# EAGLE design COTS (EAGLE 9.6.2)
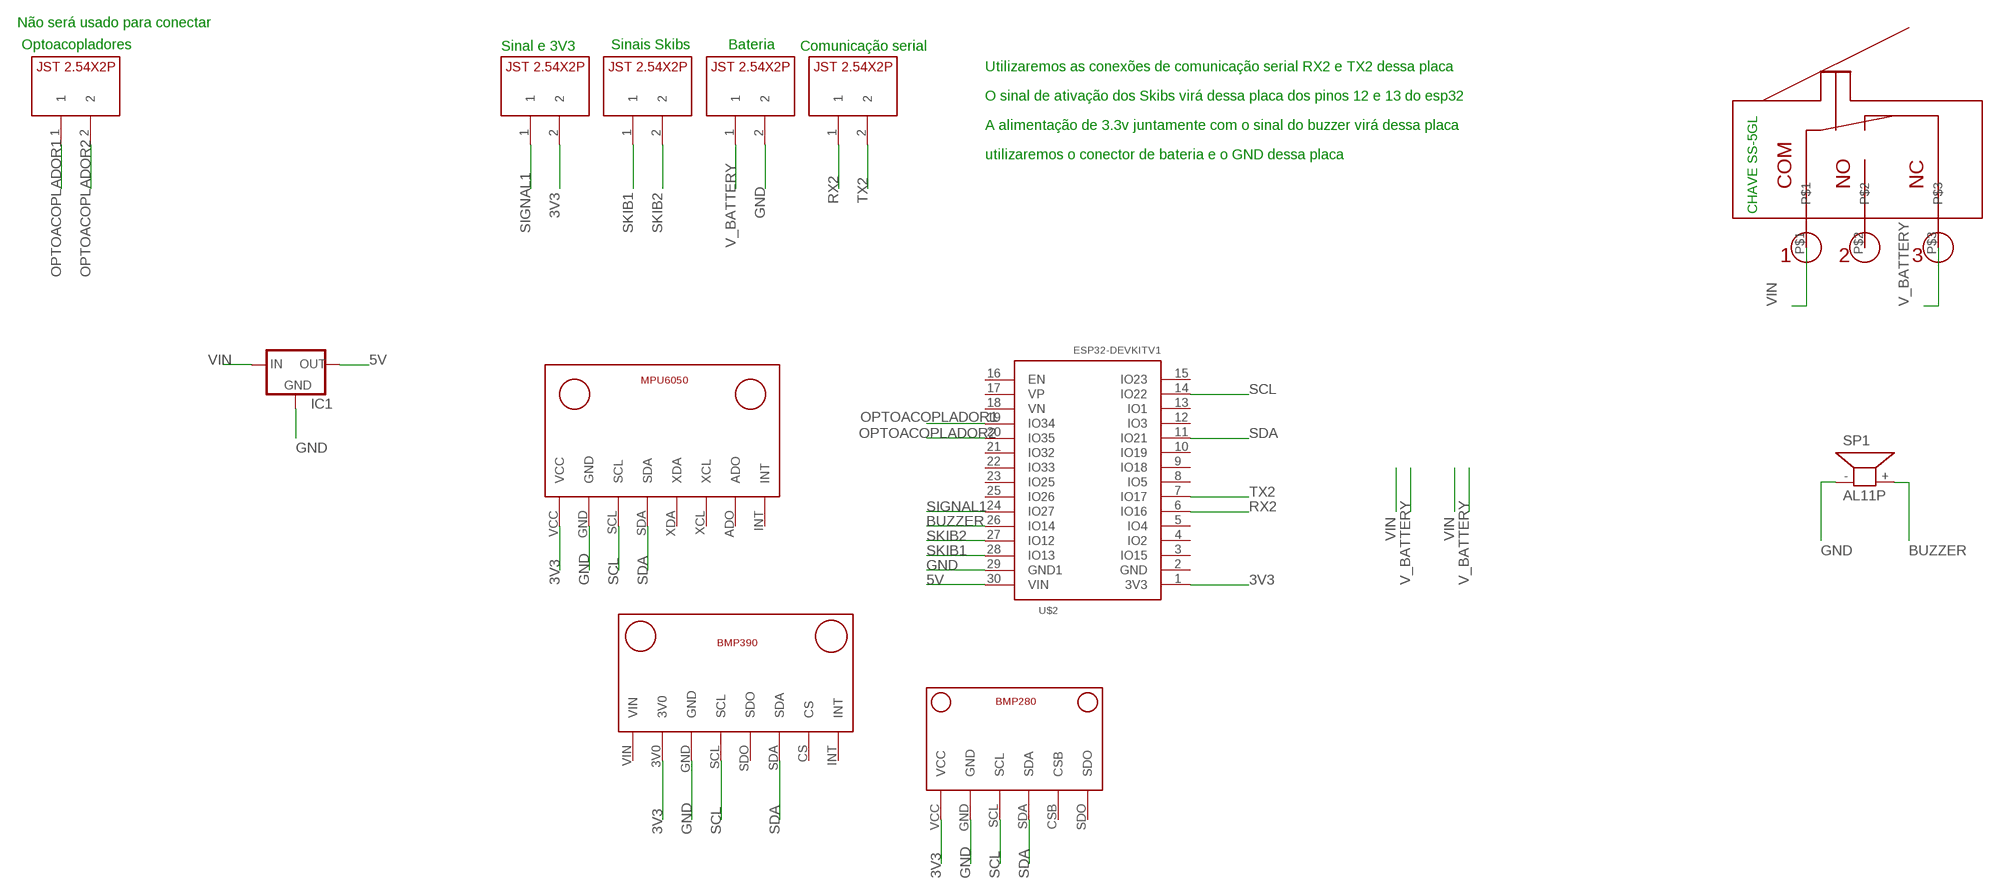
[diagram p0: schematic, sheet 1]

## Parts
IC1  78XXL  [78XXL]
SP1  AL11P  [AL11P]
U$1  MPU6050V1  [MPU6050_FOOTPRINT]
U$2  ESP32DEVKITV1  [ESP32-DEVKITV1]
U$3  BMP390V1  [BMP390_FOOTPRINT]
U$4  JST2.54X2P  [JST2.54X2P_FOOTPRINT]
U$5  JST2.54X2P  [JST2.54X2P_FOOTPRINT]
U$6  JST2.54X2P  [JST2.54X2P_FOOTPRINT]
U$7  JST2.54X2P  [JST2.54X2P_FOOTPRINT]
U$8  CHAVE_SS-5GL  [CHAVESS-5GL]
U$9  JST2.54X2P  [JST2.54X2P_FOOTPRINT]
U$10  BMP280V1  [BMP280_FOOTPRINT]

## Nets
3V3: U$1.VCC U$2.1(3V3) U$3.3V0 U$5.2 U$10.VCC
5V: IC1.OUT U$2.30(VIN)
BUZZER: SP1.+ U$2.26(IO14)
GND: IC1.GND SP1.- U$1.GND U$2.29(GND1) U$3.GND U$6.2 U$10.GND
OPTOACOPLADOR1: U$2.19(IO34) U$9.1
OPTOACOPLADOR2: U$2.20(IO35) U$9.2
RX2: U$2.6(IO16) U$7.1
SCL: U$1.SCL U$2.14(IO22) U$3.SCL U$10.SCL
SDA: U$1.SDA U$2.11(IO21) U$3.SDA U$10.SDA
SIGNAL1: U$2.24(IO27) U$5.1
SKIB1: U$2.28(IO13) U$4.1
SKIB2: U$2.27(IO12) U$4.2
TX2: U$2.7(IO17) U$7.2
V_BATTERY: U$6.1 U$8.P$3
VIN: IC1.IN U$8.P$1
Unconnected: U$1.ADO U$1.INT U$1.XCL U$1.XDA U$2.2(GND) U$2.3(IO15) U$2.4(IO2) U$2.5(IO4) U$2.8(IO5) U$2.9(IO18) U$2.10(IO19) U$2.12(IO3) U$2.13(IO1) U$2.15(IO23) U$2.16(EN) U$2.17(VP) U$2.18(VN) U$2.21(IO32) U$2.22(IO33) U$2.23(IO25) U$2.25(IO26) U$3.CS U$3.INT U$3.SDO U$3.VIN U$8.P$2 U$10.CSB U$10.SDO

## Notes on the sheet
- Não será usado para conectar
- Optoacopladores | Sinal e 3V3 | Sinais Skibs | Bateria | Comunicação serial
- Utilizaremos as conexões de comunicação serial RX2 e TX2 dessa placa
- O sinal de ativação dos Skibs virá dessa placa dos pinos 12 e 13 do esp32
- A alimentação de 3.3v juntamente com o sinal do buzzer virá dessa placa
- utilizaremos o conector de bateria e o GND dessa placa

## Library data of the parts
IC1 = v-reg:78XXL: VOLTAGE REGULATOR
SP1 = buzzer:AL11P: SPEAKER Source: Buerklin; OC_FARNELL: unknown; OC_NEWARK: unknown
U$1 = CRD:MPU6050: Acelerômetro e Giroscópio
U$2 = ESP32-DEVKITV1:ESP32DEVKITV1
U$3 = CRD:BMP390: Sensor barométrico
U$4-U$7 U$9 = CRD:JST2.54X2P: Conector JST 2 pinos (2.54mm de distância entre pinos)
U$8 = CRD:CHAVE_SS-5GL
U$10 = CRD:BMP280: Sensor barométrico

## Board
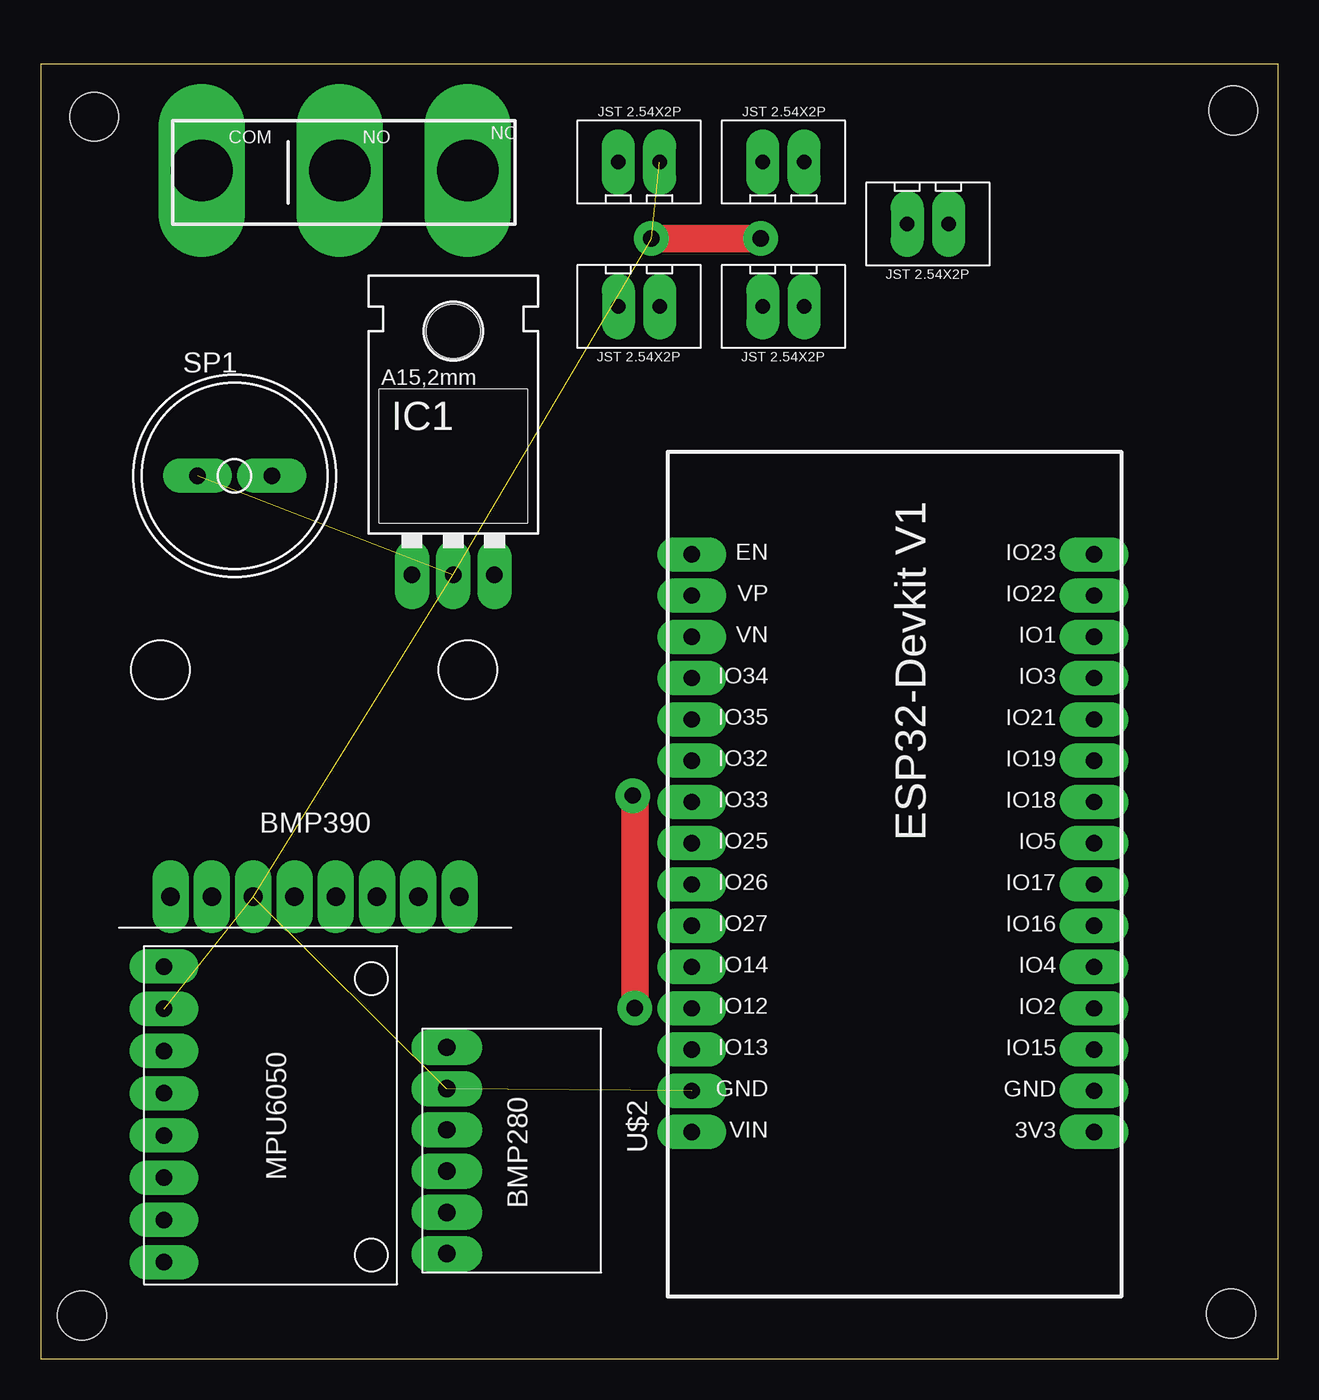
[diagram p1: board, top side]
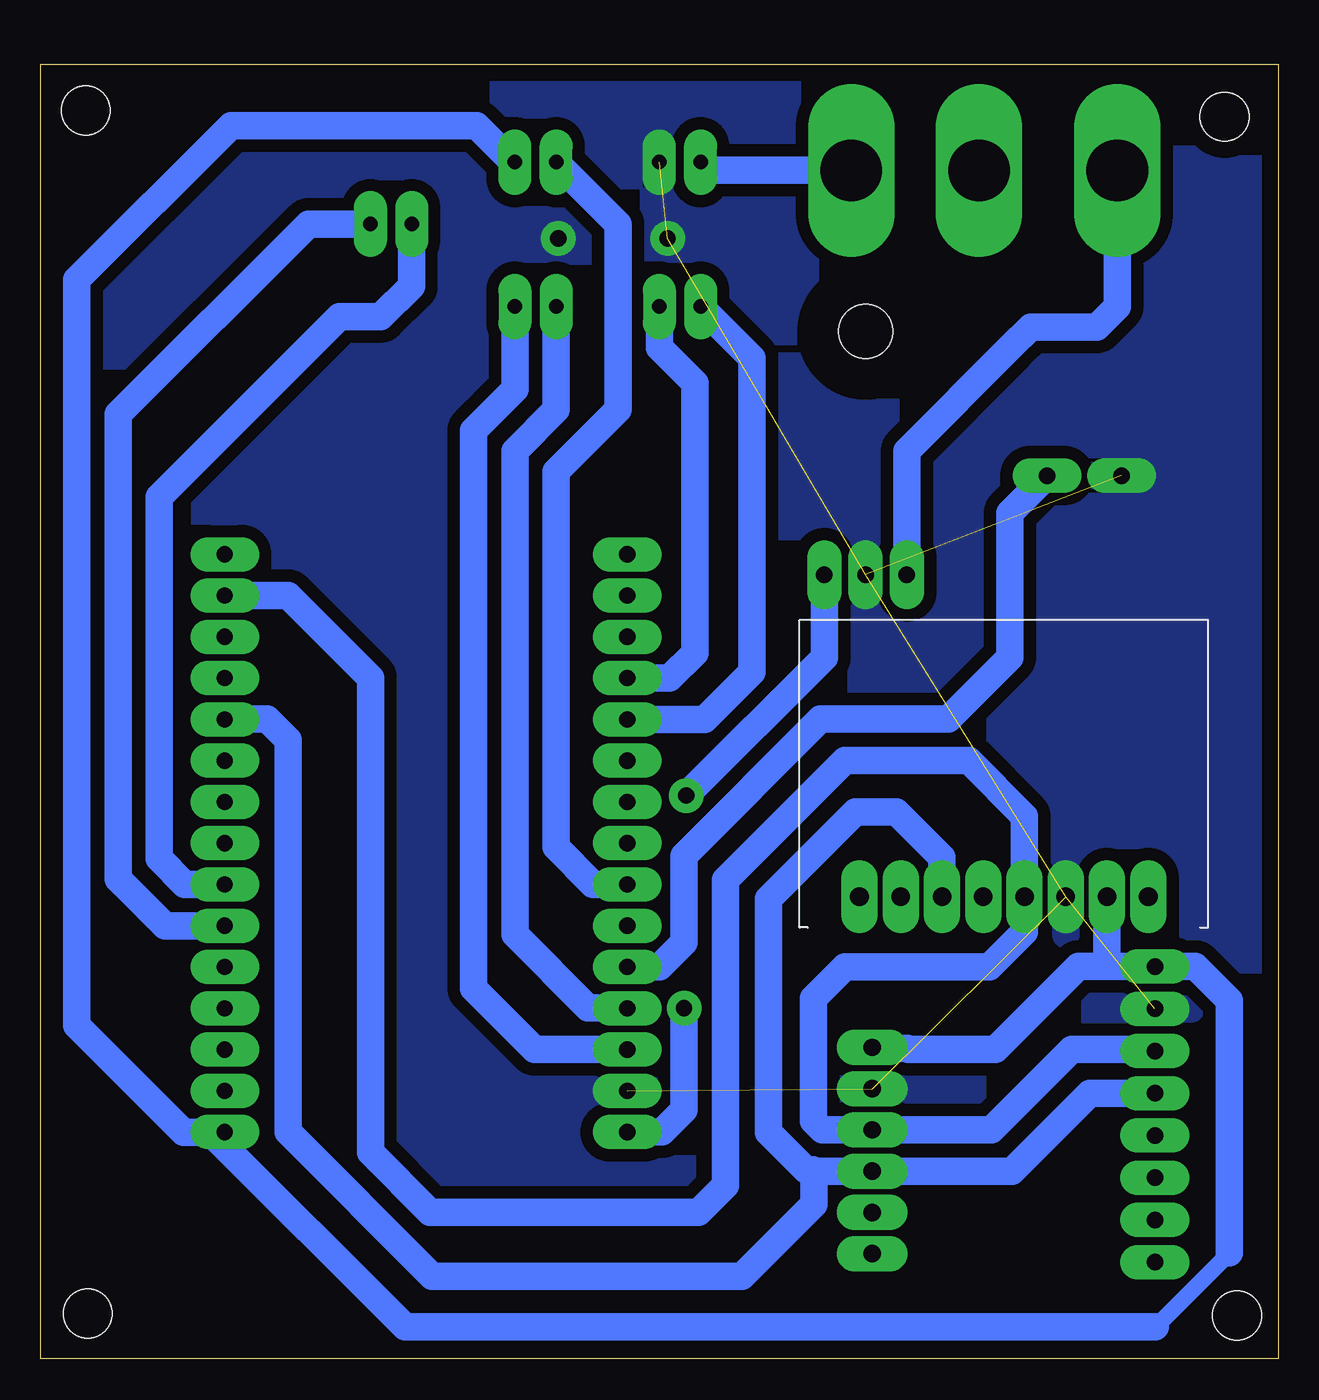
[diagram p2: board, bottom side, seen from below]

Size 76.18 x 79.68 mm. Coordinates in mm from the lower left corner, seen from the top.
Outline: 0,79.68 0,0 76.18,0 76.18,79.68 0,79.68
Copper layers (1*16): Top 0.035mm / dielectric 1.5mm / Bottom 0.035mm
Design rules "config *": minimum track width 1.7mm, minimum drill 1mm, track to track 30mil, track to pad 20mil, pad to pad 6mil, via to via 6mil, smd to smd 6mil, copper to edge 40mil, drill to drill 6mil, minimum pad ring 22mil, minimum via ring 22mil, stop-mask expansion 4mil, vias tented up to drill 0mil, thermal gap 0mil
Holes 3 mm at 2.54,2.67 3.3,76.45 73.28,2.79 73.41,76.83

### Footprints (pad centres in the part's own frame; a part is rotated, then mirrored left to right if it is on the bottom)
78XXL = drill 1.016 long: GND 0,-3.81; IN -2.54,-3.81; OUT 2.54,-3.81 | hole 3.302: 0,11.176
AL11P = drill 1.016 pad 1.905 long: + 2.286,0; - -2.286,0
MPU6050_FOOTPRINT = drill 1.016 long: ADO 6.686,-10.184; GND -6.314,-10.184; INT 9.286,-10.184; SCL -3.715,-10.184; SDA -1.115,-10.184; VCC -8.915,-10.184; XCL 4.085,-10.184; XDA 1.486,-10.184
ESP32-DEVKITV1 = drill 1 pad 1.016 long: 1 -22.87,-13.54; 2 -20.33,-13.54; 3 -17.79,-13.54; 4 -15.25,-13.54; 5 -12.71,-13.54; 6 -10.17,-13.54; 7 -7.63,-13.54; 8 -5.09,-13.54; 9 -2.55,-13.54; 10 -0.01,-13.54; 11 2.53,-13.54; 12 5.07,-13.54; 13 7.61,-13.54; 14 10.15,-13.54; 15 12.69,-13.54; 16 12.69,11.23; 17 10.15,11.23; 18 7.61,11.23; 19 5.07,11.23; 20 2.53,11.23; 21 -0.01,11.23; 22 -2.55,11.23; 23 -5.09,11.23; 24 -7.63,11.23; 25 -10.17,11.23; 26 -12.71,11.23; 27 -15.25,11.23; 28 -17.79,11.23; 29 -20.33,11.23; 30 -22.87,11.23
BMP390_FOOTPRINT = drill 1.143 long: 3V0 -5.969,-8.382; CS 6.731,-8.382; GND -3.429,-8.382; INT 9.271,-8.382; SCL -0.889,-8.382; SDA 4.191,-8.382; SDO 1.651,-8.382; VIN -8.509,-8.382
JST2.54X2P_FOOTPRINT = drill 0.9 long: 1 -1.27,0; 2 1.27,0
CHAVESS-5GL = drill 3.8 pad 3.048 long: P$1 -9.144,0.762; P$2 -0.635,0.762; P$3 7.239,0.762
BMP280_FOOTPRINT = drill 1.067 long: CSB 3.686,-6.12; GND -3.934,-6.12; SCL -1.395,-6.12; SDA 1.145,-6.12; SDO 6.226,-6.12; VCC -6.474,-6.12

### Placement (x,y rotation side)
IC1  25.4,52.07 0 top
SP1  11.94,54.36 0 top
U$1  17.78,15.24 270 top
U$2  51.31,36.83 90 top
U$3  16.51,36.83 0 top
U$4  45.72,64.77 180 top
U$5  45.72,73.66 0 top
U$6  36.83,73.66 0 top
U$7  54.61,69.85 180 top
U$8  19.05,72.39 0 top
U$9  36.83,64.77 180 top
U$10  31.11,12.7 270 top

### Tracks (layer width: path | path; a pad name or v marks a point on that pad's centre or on a via)
3V3
  Bottom 1.05: 3.01,6.54 3.01,6.51 7.53,1.98 7.57,1.98
  Bottom 1.7: U$5.2 47.09,73.66 49.35,75.92 64.47,75.92 73.94,66.44 73.94,20.53 67.36,13.95 65.61,13.95 | 65.61,13.95 U$2.1 | 7.57,1.98 53.76,1.98 65.61,13.83 65.61,13.95 | 3.01,6.54 3.01,22.06 5.1,24.15 U$1.VCC 10.16,24.15 | 10.16,24.15 12.29,24.15 17.4,19.05 22.76,19.05 22.83,19.12 24.94,19.12 U$10.VCC | U$3.3V0 10.54,24.54 10.16,24.15
5V  (via drill 1)
  Top 1.7: v36.45,34.67 36.58,34.54 v36.58,21.59
  Bottom 1.7: v36.58,21.59 36.58,15.32 37.93,13.96 38.09,13.96 38.1,13.97 39.37,13.97 39.38,13.96 U$2.30 | v36.45,34.67 27.94,43.18 IC1.OUT
BUZZER
  Bottom 1.7: U$2.26 38.1,24.12 36.58,25.64 36.58,30.96 28.17,39.37 20.32,39.37 16.51,43.18 16.51,52.07 SP1.+
GND  (via drill 1)  (7 unrouted)
  Top 1.7: v37.59,68.96 v44.32,68.96
  pour Bottom: 1.27,78.74 1.27,1.27 74.93,1.27 74.93,78.74
OPTOACOPLADOR1
  Bottom 1.7: U$9.1 38.1,62.23 35.92,60.05 35.92,43.46 37.48,41.9 U$2.19
OPTOACOPLADOR2
  Bottom 1.7: U$2.20 35.32,39.36 32.38,42.29 32.38,61.59 U$9.2
RX2
  Bottom 1.7: U$7.1 59.69,69.85 71.4,58.14 71.4,29.54 68.52,26.66 U$2.6
SCL
  Bottom 1.7: U$2.14 64.84,46.99 60.96,46.99 55.88,41.91 55.88,12.7 52.2,9.02 35.69,9.02 34.04,10.67 34.04,29.46 26.67,36.83 19.05,36.83 15.62,33.4 U$3.SCL 15.62,26.29 17.78,24.13 26.67,24.13 28.62,22.18 28.62,14.65 28.06,14.1 U$10.SCL 17.66,14.1 12.7,19.05 7.69,19.05 U$1.SCL
SDA
  Bottom 1.7: U$2.11 64.84,39.37 62.23,39.37 60.96,38.1 60.96,13.97 52.07,5.08 33.02,5.08 28.58,9.52 28.58,11.55 | U$1.SDA 11.59,16.36 16.39,11.55 U$10.SDA 28.58,11.55 | U$3.SDA 20.7,30.86 23.5,33.66 26.04,33.66 31.39,28.3 31.39,13.94 29.08,11.63 28.66,11.63 28.58,11.55
SIGNAL1
  Bottom 1.7: U$5.1 40.64,69.85 40.64,58.42 44.45,54.61 44.45,31.5 42.16,29.21 U$2.24
SKIB1
  Bottom 1.7: U$2.28 45.77,19.04 49.53,22.8 49.53,57.15 46.99,59.69 U$4.1
SKIB2
  Bottom 1.7: U$4.2 44.45,58.42 46.99,55.88 46.99,26.13 42.48,21.62 40.11,21.62 U$2.27
TX2
  Bottom 1.7: U$7.2 53.34,66.04 55.24,64.14 57.78,64.14 68.89,53.03 68.89,30.79 67.3,29.2 U$2.7
V_BATTERY
  Bottom 1.7: U$6.1 35.05,73.15 U$8.P$3
VIN
  Bottom 1.7: U$8.P$1 9.91,64.77 11.18,63.5 15.24,63.5 16.51,62.23 22.86,55.88 IC1.IN